# EAGLE design leddriverx3 (EAGLE 9.4.2)
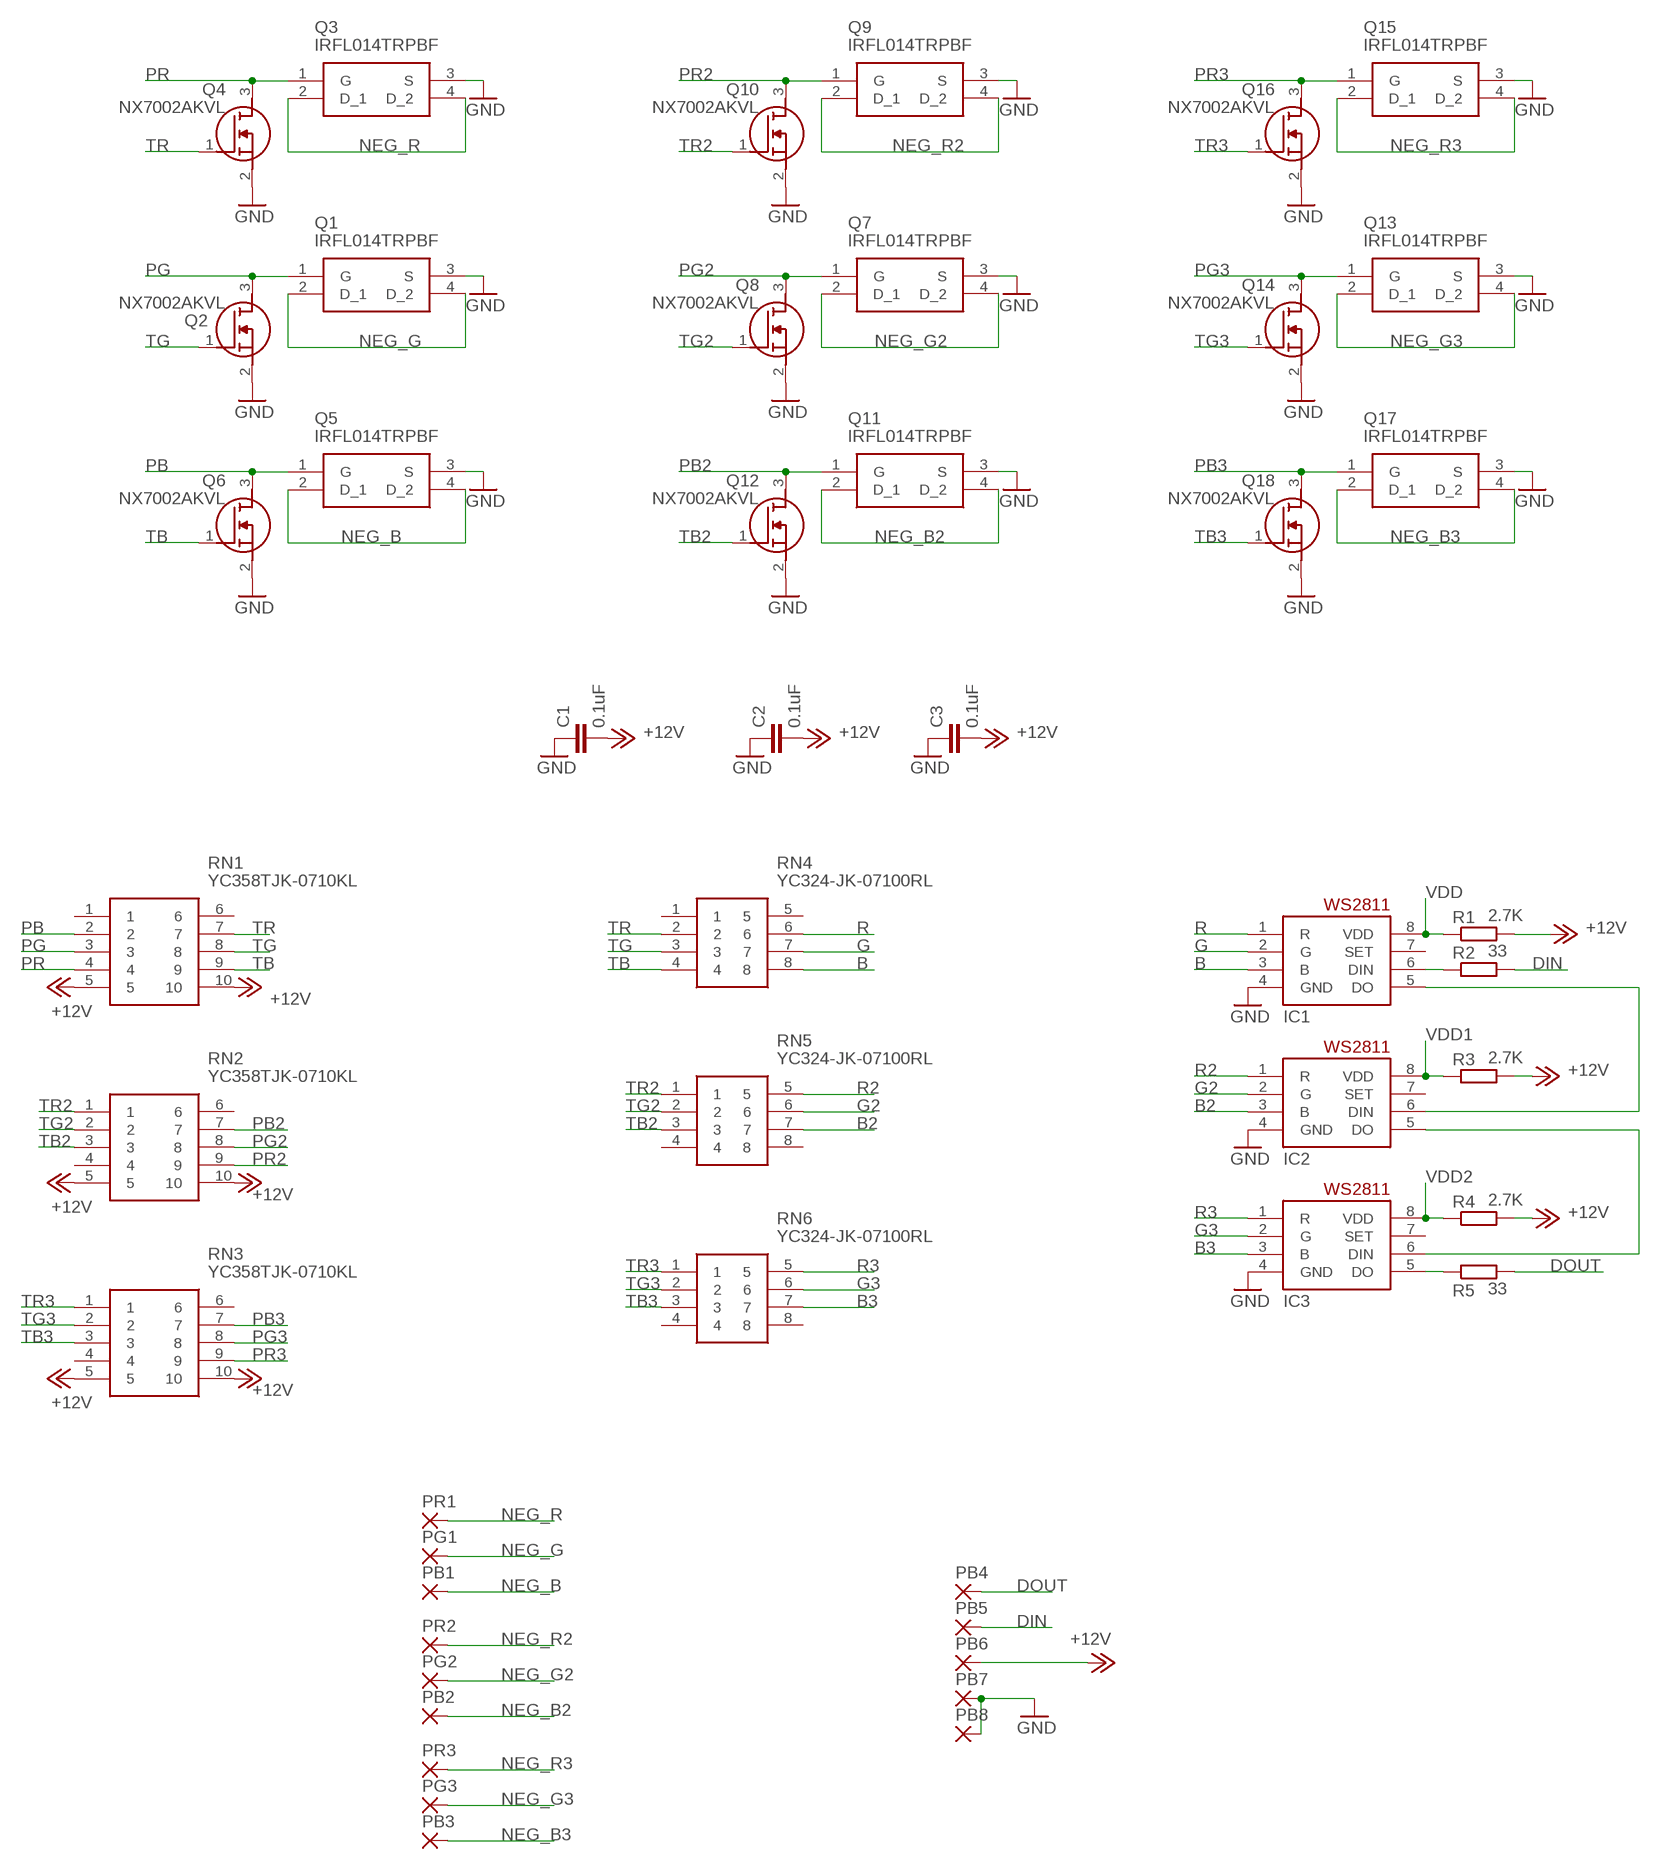
[diagram p0: schematic, sheet 1]

## Parts
C1  0.1uF  C-EUC1206  [C1206]
C2  0.1uF  C-EUC1206  [C1206]
C3  0.1uF  C-EUC1206  [C1206]
IC1  WS2811-SOP8  [SO08-SKINNYPADS]
IC2  WS2811-SOP8  [SO08-SKINNYPADS]
IC3  WS2811-SOP8  [SO08-SKINNYPADS]
PB1  3,81/1,4  [3,81/1,4]
PB2  3,81/1,4  [3,81/1,4]
PB3  3,81/1,4  [3,81/1,4]
PB4  3,81/1,4  [3,81/1,4]
PB5  3,81/1,4  [3,81/1,4]
PB6  3,81/1,4  [3,81/1,4]
PB7  3,81/1,4  [3,81/1,4]
PB8  3,81/1,4  [3,81/1,4]
PG1  3,81/1,4  [3,81/1,4]
PG2  3,81/1,4  [3,81/1,4]
PG3  3,81/1,4  [3,81/1,4]
PR1  3,81/1,4  [3,81/1,4]
PR2  3,81/1,4  [3,81/1,4]
PR3  3,81/1,4  [3,81/1,4]
Q1  IRFL014TRPBF  [SOT230P700X180-4N]
Q2  NX7002AKVL  [SOT95P230X110-3N]
Q3  IRFL014TRPBF  [SOT230P700X180-4N]
Q4  NX7002AKVL  [SOT95P230X110-3N]
Q5  IRFL014TRPBF  [SOT230P700X180-4N]
Q6  NX7002AKVL  [SOT95P230X110-3N]
Q7  IRFL014TRPBF  [SOT230P700X180-4N]
Q8  NX7002AKVL  [SOT95P230X110-3N]
Q9  IRFL014TRPBF  [SOT230P700X180-4N]
Q10  NX7002AKVL  [SOT95P230X110-3N]
Q11  IRFL014TRPBF  [SOT230P700X180-4N]
Q12  NX7002AKVL  [SOT95P230X110-3N]
Q13  IRFL014TRPBF  [SOT230P700X180-4N]
Q14  NX7002AKVL  [SOT95P230X110-3N]
Q15  IRFL014TRPBF  [SOT230P700X180-4N]
Q16  NX7002AKVL  [SOT95P230X110-3N]
Q17  IRFL014TRPBF  [SOT230P700X180-4N]
Q18  NX7002AKVL  [SOT95P230X110-3N]
R1  2.7K  R-EU_R1206  [R1206]
R2  33  R-EU_R1206  [R1206]
R3  2.7K  R-EU_R1206  [R1206]
R4  2.7K  R-EU_R1206  [R1206]
R5  33  R-EU_R1206  [R1206]
RN1  YC358TJK-0710KL  [YC358T]
RN2  YC358TJK-0710KL  [YC358T]
RN3  YC358TJK-0710KL  [YC358T]
RN4  YC324-JK-07100RL  [YC324JK07100RL]
RN5  YC324-JK-07100RL  [YC324JK07100RL]
RN6  YC324-JK-07100RL  [YC324JK07100RL]

## Nets
+12V: C1.2 C2.2 C3.2 PB6.1(P) R1.2 R3.2 R4.2 RN1.5 RN1.10 RN2.5 RN2.10 RN3.5 RN3.10
B: IC1.3(B) RN4.8
B2: IC2.3(B) RN5.7
B3: IC3.3(B) RN6.7
DIN: PB5.1(P) R2.2
DOUT: PB4.1(P) R5.2
G: IC1.2(G) RN4.7
G2: IC2.2(G) RN5.6
G3: IC3.2(G) RN6.6
GND: C1.1 C2.1 C3.1 IC1.4(GND) IC2.4(GND) IC3.4(GND) PB7.1(P) PB8.1(P) Q1.3(S) Q2.2(S) Q3.3(S) Q4.2(S) Q5.3(S) Q6.2(S) Q7.3(S) Q8.2(S) Q9.3(S) Q10.2(S) Q11.3(S) Q12.2(S) Q13.3(S) Q14.2(S) Q15.3(S) Q16.2(S) Q17.3(S) Q18.2(S)
N$1: IC1.6(DIN) R2.1
N$2: IC3.5(DO) R5.1
N$5: IC1.5(DO) IC2.6(DIN)
N$11: IC2.5(DO) IC3.6(DIN)
NEG_B: PB1.1(P) Q5.2(D_1) Q5.4(D_2)
NEG_B2: PB2.1(P) Q11.2(D_1) Q11.4(D_2)
NEG_B3: PB3.1(P) Q17.2(D_1) Q17.4(D_2)
NEG_G: PG1.1(P) Q1.2(D_1) Q1.4(D_2)
NEG_G2: PG2.1(P) Q7.2(D_1) Q7.4(D_2)
NEG_G3: PG3.1(P) Q13.2(D_1) Q13.4(D_2)
NEG_R: PR1.1(P) Q3.2(D_1) Q3.4(D_2)
NEG_R2: PR2.1(P) Q9.2(D_1) Q9.4(D_2)
NEG_R3: PR3.1(P) Q15.2(D_1) Q15.4(D_2)
PB: Q5.1(G) Q6.3(D) RN1.2
PB2: Q11.1(G) Q12.3(D) RN2.7
PB3: Q17.1(G) Q18.3(D) RN3.7
PG: Q1.1(G) Q2.3(D) RN1.3
PG2: Q7.1(G) Q8.3(D) RN2.8
PG3: Q13.1(G) Q14.3(D) RN3.8
PR: Q3.1(G) Q4.3(D) RN1.4
PR2: Q9.1(G) Q10.3(D) RN2.9
PR3: Q15.1(G) Q16.3(D) RN3.9
R: IC1.1(R) RN4.6
R2: IC2.1(R) RN5.5
R3: IC3.1(R) RN6.5
TB: Q6.1(G) RN1.9 RN4.4
TB2: Q12.1(G) RN2.3 RN5.3
TB3: Q18.1(G) RN3.3 RN6.3
TG: Q2.1(G) RN1.8 RN4.3
TG2: Q8.1(G) RN2.2 RN5.2
TG3: Q14.1(G) RN3.2 RN6.2
TR: Q4.1(G) RN1.7 RN4.2
TR2: Q10.1(G) RN2.1 RN5.1
TR3: Q16.1(G) RN3.1 RN6.1
VDD: IC1.8(VDD) R1.1
VDD1: IC2.8(VDD) R3.1
VDD2: IC3.8(VDD) R4.1
Unconnected: IC1.7(SET) IC2.7(SET) IC3.7(SET) RN1.1 RN1.6 RN2.4 RN2.6 RN3.4 RN3.6 RN4.1 RN4.5 RN5.4 RN5.8 RN6.4 RN6.8

## Library data of the parts
C1-C3 = rcl:C-EU: CAPACITOR, European symbol; SPICEPREFIX: C
IC1-IC3 = adafruit_wsled:WS2811
PB1-PB8 PG1-PG3 PR1-PR3 = wirepad:3,81/1,4: THROUGH-HOLE PAD
Q1 Q3 Q5 Q7 Q9 Q11 Q13 Q15 Q17 = SamacSys_Parts:IRFL014TRPBF: Vishay IRFL014TRPBF N-channel MOSFET Transistor, 2.7 A, 60 V, 3-Pin SOT-223 Source: Datasheet <https://componentsearchengine.com/Datasheets/1/IRFL014TRPBF.pdf>; DESCRIPTION: Vishay IRFL014TRPBF N-channel MOSFET Transistor, 2.7 A, 60 V, 3-Pin SOT-223; HEIGHT: 1.8mm; MANUFACTURER_NAME: Vishay; MANUFACTURER_PART_NUMBER: IRFL014TRPBF; MOUSER_PART_NUMBER: 844-IRFL014TRPBF; MOUSER_PRICE-STOCK: https://www.mouser.com/Search/Refine.aspx?Keyword=844-IRFL014TRPBF
Q2 Q4 Q6 Q8 Q10 Q12 Q14 Q16 Q18 = SamacSys_Parts:NX7002AKVL: Trans MOSFET N-CH 60V 0.19A 3-Pin TO-236AB Source: Datasheet <https://componentsearchengine.com/Datasheets/1/NX7002AKVL.pdf>; DESCRIPTION: Trans MOSFET N-CH 60V 0.19A 3-Pin TO-236AB; HEIGHT: 1.1mm; MANUFACTURER_NAME: Nexperia; MANUFACTURER_PART_NUMBER: NX7002AKVL; MOUSER_PART_NUMBER: 771-NX7002AKVL; MOUSER_PRICE-STOCK: https://www.mouser.com/Search/Refine.aspx?Keyword=771-NX7002AKVL
R1-R5 = rcl:R-EU_: RESISTOR, European symbol; SPICEPREFIX: R
RN1-RN3 = SamacSys_Parts:YC358TJK-0710KL: Resistor Networks & Arrays 10K 5% CONVEX SQUARE 8X1225 Source: Datasheet <https://componentsearchengine.com/Datasheets/1/YC358TJK-0710KL.pdf>; DESCRIPTION: Resistor Networks & Arrays 10K 5% CONVEX SQUARE 8X1225; HEIGHT: mm; MANUFACTURER_NAME: YAGEO (PHYCOMP); MANUFACTURER_PART_NUMBER: YC358TJK-0710KL; MOUSER_PART_NUMBER: 603-YC358TJK-0710KL; MOUSER_PRICE-STOCK: https://www.mouser.com/Search/Refine.aspx?Keyword=603-YC358TJK-0710KL
RN4-RN6 = SamacSys_Parts:YC324-JK-07100RL: Resistor Networks & Arrays Source: Datasheet <https://componentsearchengine.com/Datasheets/1/YC324-JK-07100RL.pdf>; DESCRIPTION: Resistor Networks & Arrays; HEIGHT: 0.6mm; MANUFACTURER_NAME: YAGEO (PHYCOMP); MANUFACTURER_PART_NUMBER: YC324-JK-07100RL; MOUSER_PART_NUMBER: 603-YC324-JK-07100RL; MOUSER_PRICE-STOCK: https://www.mouser.com/Search/Refine.aspx?Keyword=603-YC324-JK-07100RL

## Board
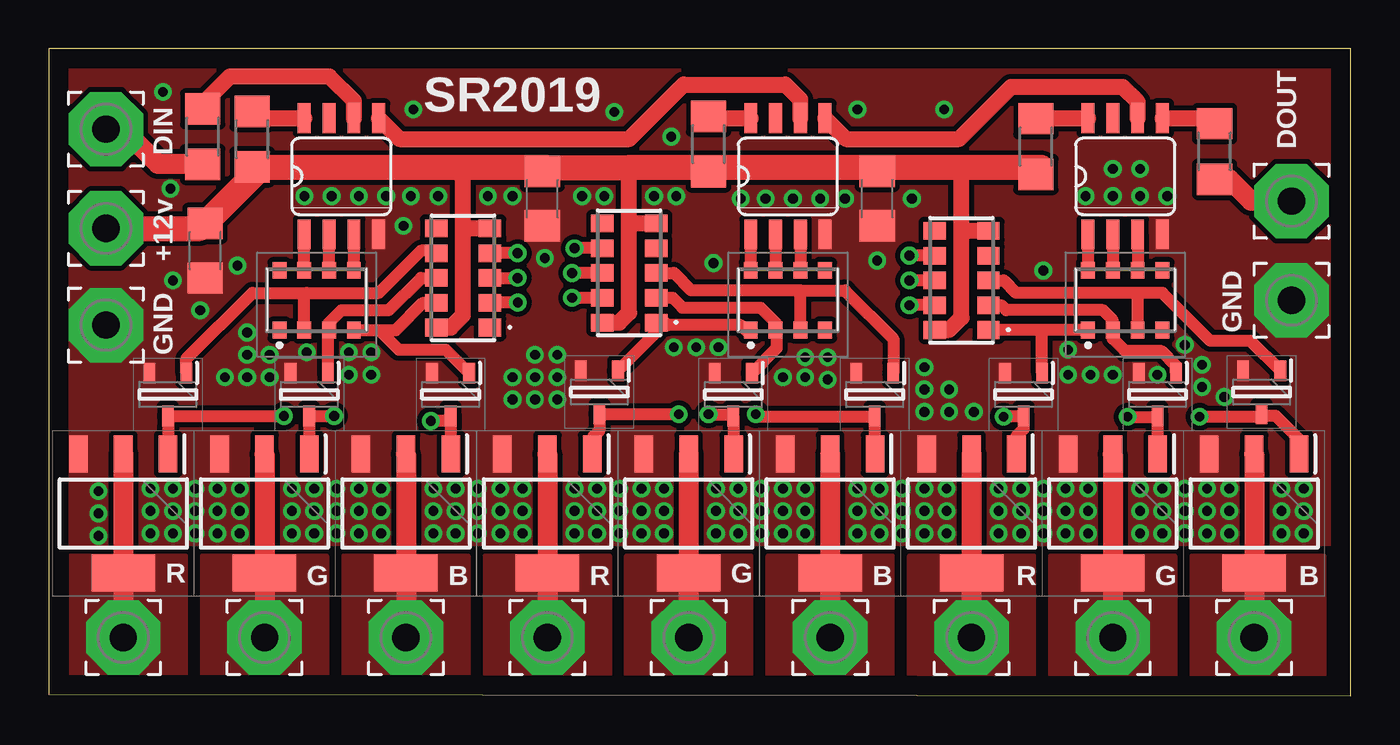
[diagram p1: board, top side]
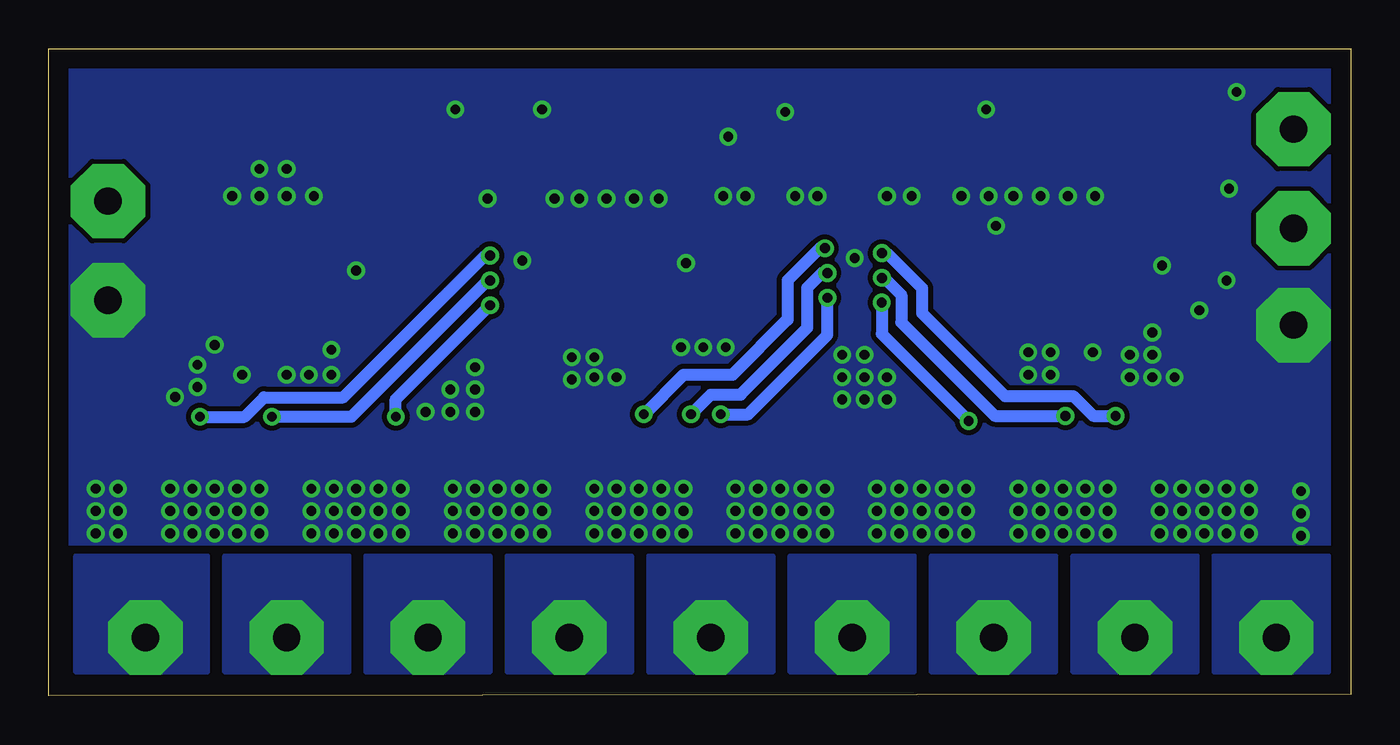
[diagram p2: board, bottom side, seen from below]

Size 66.66 x 33.14 mm. Coordinates in mm from the lower left corner, seen from the top.
Outline: 0,0.06 66.66,0 66.66,33.14 0,33.14 0,0.06
Copper layers (1*16): Top 0.035mm / dielectric 1.5mm / Bottom 0.035mm
Design rules "default *": minimum track width 6mil, minimum drill 0.35mm, track to track 6mil, track to pad 6mil, pad to pad 6mil, via to via 6mil, smd to smd 6mil, copper to edge 40mil, drill to drill 6mil, minimum pad ring 10mil, minimum via ring 8mil, stop-mask expansion 4mil, vias tented up to drill 100mil, thermal gap 10mil

### Footprints (pad centres in the part's own frame; a part is rotated, then mirrored left to right if it is on the bottom)
C1206 = smd 1.6 x 1.8: 1 -1.4,0; 2 1.4,0
SO08-SKINNYPADS = smd 0.66 x 1.524: 1 -1.905,-2.973; 2 -0.635,-2.973; 3 0.635,-2.973; 4 1.905,-2.973; 5 1.905,2.973; 6 0.635,2.973; 7 -0.635,2.973; 8 -1.905,2.973
3,81/1,4 = drill 1.397 pad 3.81 octagon: 1 0,0
SOT230P700X180-4N = smd 1.9 x 0.95: 1 -3.05,2.3; 2 -3.05,0; 3 -3.05,-2.3 | smd 1.9 x 3.25: 4 3.05,0
SOT95P230X110-3N = smd 1.05 x 0.6: 1 -1.1,0.95; 2 -1.1,-0.95; 3 1.1,0
R1206 = smd 1.6 x 1.803: 1 -1.422,0; 2 1.422,0
YC358T = smd 0.9 x 1.15: 1 -2.54,-1.375; 2 -1.27,-1.375; 3 0,-1.375; 4 1.27,-1.375; 5 2.54,-1.375; 6 2.54,1.375; 7 1.27,1.375; 8 0,1.375; 9 -1.27,1.375; 10 -2.54,1.375
YC324JK07100RL = smd 0.71 x 0.85: 1 -1.905,-1.525; 2 -0.635,-1.525; 3 0.635,-1.525; 4 1.905,-1.525; 5 -1.905,1.525; 6 -0.635,1.525; 7 0.635,1.525; 8 1.905,1.525

### Placement (x,y rotation side)
C1  25.27,25.46 90 top
C2  8,22.8 90 top
C3  42.42,25.46 90 top
IC1  14.99,26.61 0 top
IC2  37.85,26.61 0 top
IC3  55.12,26.61 0 top
PB1  18.29,2.98 180 top
PB2  40,2.98 0 top
PB3  61.72,2.98 0 top
PB4  63.63,25.34 0 top
PB5  2.92,29.02 0 top
PB6  2.92,23.94 0 top
PB7  2.92,18.99 0 top
PB8  63.63,20.26 0 top
PG1  11.05,2.98 180 top
PG2  32.77,2.98 0 top
PG3  54.48,2.98 0 top
PR1  3.81,2.98 180 top
PR2  25.53,2.98 0 top
PR3  47.24,2.98 0 top
Q1  11.05,9.33 270 top
Q2  13.33,15.43 270 top
Q3  3.81,9.33 270 top
Q4  6.1,15.43 270 top
Q5  18.29,9.33 270 top
Q6  20.57,15.43 270 top
Q7  32.77,9.33 270 top
Q8  35.05,15.43 270 top
Q9  25.53,9.33 270 top
Q10  28.19,15.56 270 top
Q11  40,9.33 270 top
Q12  42.29,15.43 270 top
Q13  54.48,9.33 270 top
Q14  56.77,15.43 270 top
Q15  47.24,9.33 270 top
Q16  49.91,15.43 270 top
Q17  61.72,9.33 270 top
Q18  62.1,15.56 270 top
R1  10.41,28.51 270 top
R2  7.87,28.64 270 top
R3  33.78,28.26 270 top
R4  50.55,28.13 270 top
R5  59.69,27.88 270 top
RN1  21.21,21.4 90 top
RN2  29.72,21.65 90 top
RN3  46.74,21.27 90 top
RN4  13.72,20.26 0 top
RN5  37.85,20.26 0 top
RN6  55.12,20.26 0 top

### Tracks (layer width: path | path; a pad name or v marks a point on that pad's centre or on a via)
+12V
  Top 0.61: C2.2 7.75,23.94 | R4.2 50.8,26.96 50.8,27.05 | R3.2 33.56,27.05 33.53,27.05 | R1.2 10.83,27.09 10.86,27.05
  Top 0.813: RN1.10 20.57,18.86 21.21,19.49 21.21,23.94 | 21.21,23.94 21.21,26.55 20.7,27.05 | RN1.5 21.21,23.94 | RN2.10 29.21,19.11 29.72,19.62 29.72,24.19 | 29.72,24.19 29.72,27.05 | RN2.5 29.72,24.19 | RN3.10 46.1,18.73 46.74,19.37 46.74,23.94 | 46.86,27.05 46.74,26.93 46.74,23.94 | RN3.5 46.86,23.81 46.74,23.94
  Top 1.27: PB6.1 7.75,23.94 10.86,27.05 20.7,27.05 25.46,27.05 | 25.46,27.05 29.72,27.05 33.53,27.05 42.61,27.05 | 50.8,27.05 46.86,27.05 42.61,27.05 | C3.2 42.61,27.05 | C1.2 25.46,27.05
B
  Top 0.61: RN4.8 IC1.3
B2
  Top 0.61: IC2.3 RN5.7
B3
  Top 0.61: IC3.3 RN6.7
DIN
  Top 1.016: R2.2 7.85,27.24 5.59,27.24 3.81,29.02 PB5.1
DOUT
  Top 1.016: PB4.1 61.57,25.34 60.45,26.45 R5.2
G
  Top 0.61: RN4.7 IC1.2
G2
  Top 0.61: IC2.2 RN5.6
G3
  Top 0.61: IC3.2 RN6.6
GND  (via drill 0.5)
  other vias: 5.21,10.6 18.54,25.59 22.48,25.59 11.3,17.46 13.21,17.59 10.16,17.46 11.3,16.32 56.77,16.45 59.05,16.95 58.17,17.97 55.88,26.99 15.87,25.59 28.96,29.91 41.4,30.04 17.27,25.59 27.3,25.59 23.75,25.59 28.45,25.59 30.99,25.59 32.13,25.59 35.43,25.46 54.48,26.99 15.37,17.59 16.51,17.59 15.37,16.45 16.51,16.45 10.16,16.32 32,17.84 33.15,17.84 34.29,17.84 31.88,28.64 10.16,18.61 9.02,16.32 26.03,17.46 26.03,16.32 24.89,17.46 24.89,16.32 26.03,15.18 24.89,15.18 23.75,15.18 23.75,16.32 6.35,10.6 5.21,9.46 5.21,8.32 6.35,9.46 6.35,8.32 7.49,10.6 8.64,10.6 9.78,10.6 7.49,9.46 8.64,9.46 9.78,9.46 9.78,8.32 7.49,8.32 8.64,8.32 12.45,10.6 13.59,10.6 12.45,9.46 12.45,8.32 13.59,9.46 13.59,8.32 14.73,10.6 15.87,10.6 17.02,10.6 14.73,9.46 15.87,9.46 17.02,9.46 17.02,8.32 14.73,8.32 15.87,8.32 19.69,10.6 20.83,10.6 19.69,9.46 19.69,8.32 20.83,9.46 20.83,8.32 21.97,10.6 23.11,10.6 24.26,10.6 21.97,9.46 23.11,9.46 24.26,9.46 24.26,8.32 21.97,8.32 23.11,8.32 26.92,10.6 28.07,10.6 26.92,9.46 26.92,8.32 28.07,9.46 28.07,8.32 29.21,10.6 30.35,10.6 31.5,10.6 29.21,9.46 30.35,9.46 31.5,9.46 31.5,8.32 29.21,8.32 30.35,8.32 34.16,10.6 35.31,10.6 34.16,9.46 34.16,8.32 35.31,9.46 35.31,8.32 36.45,10.6 37.59,10.6 38.73,10.6 36.45,9.46 37.59,9.46 38.73,9.46 38.73,8.32 36.45,8.32 37.59,8.32 41.4,10.6 42.54,10.6 41.4,9.46 41.4,8.32 42.54,9.46 42.54,8.32 43.69,10.6 44.83,10.6 45.97,10.6 43.69,9.46 44.83,9.46 45.97,9.46 45.97,8.32 43.69,8.32 44.83,8.32 48.64,10.6 49.78,10.6 48.64,9.46 48.64,8.32 49.78,9.46 49.78,8.32 50.93,10.6 52.07,10.6 53.21,10.6 50.93,9.46 52.07,9.46 53.21,9.46 53.21,8.32 50.93,8.32 52.07,8.32 55.88,10.6 57.02,10.6 55.88,9.46 55.88,8.32 57.02,9.46 57.02,8.32 58.17,10.6 59.31,10.6 60.45,10.6 58.17,9.46 59.31,9.46 60.45,9.46 60.45,8.32 58.17,8.32 59.31,8.32 63.12,10.6 64.26,10.6 63.12,9.46 64.26,9.46 64.26,8.32 63.12,8.32 2.54,10.48 2.54,9.33 2.54,8.19 53.09,25.59 54.48,25.59 55.88,25.59 57.28,25.59 19.94,25.59 18.16,24.07 45.85,30.04 18.67,30.04 6.22,25.97 5.84,30.92 39.88,17.34 39.88,16.19 38.73,17.34 38.73,16.32 37.59,16.32 47.37,14.54 46.1,14.54 44.83,14.54 44.83,15.68 46.1,15.68 54.48,16.45 53.34,16.45 52.2,16.45 52.2,17.72 59.05,15.81 60.2,15.3 44.83,16.83 14.48,25.59 13.08,25.59 6.35,21.27 40.77,25.46 39.5,25.46 38.1,25.46 36.7,25.46 42.42,22.29 44.2,25.46 25.4,22.42 7.75,19.75 9.65,22.03 34.04,22.16 50.93,21.78
  pour Bottom (isolate 0.254, no thermals): -1.4,35.24 -1.4,8.95 67.18,8.95 67.18,35.24
  pour Top (isolate 0.254, no thermals): -0.89,34.86 -0.89,7.81 67.44,7.81 67.44,34.86
  pour Bottom (isolate 0.254, no thermals): -0.13,34.99 -0.13,7.81 67.18,7.81 67.18,34.99
N$1
  Top 0.813: IC1.6 15.62,30.47 14.38,31.71 9.27,31.71 7.87,30.31 R2.1
N$2
  Top 0.813: IC3.5 59.69,29.58 R5.1
N$5
  Top 0.813: IC1.5 17.96,28.51 29.72,28.51 32.51,31.31 37.72,31.31 38.48,30.54 IC2.6
N$11
  Top 0.813: IC2.5 40.82,28.51 46.61,28.51 49.28,31.18 54.99,31.18 55.75,30.42 IC3.6
NEG_B
  Top 1.016: Q5.2 Q5.4 PB1.1
  pour Top (isolate 0.254, no thermals): 15.11,7.18 21.46,7.18 21.46,0.19 15.24,0.19 15.11,0.19
  pour Bottom (no thermals): 15.11,1.21 21.46,1.21 21.46,7.18 15.11,7.18
NEG_B2
  Top 1.016: Q11.2 Q11.4 PB2.1
  pour Top (isolate 0.254, no thermals): 36.83,7.18 43.18,7.18 43.18,0.44 36.83,0.44
  pour Bottom (no thermals): 36.83,1.21 43.18,1.21 43.18,7.18 36.83,7.18
NEG_B3
  Top 1.016: Q17.2 Q17.4 PB3.1
  pour Top (isolate 0.254, no thermals): 58.55,7.18 65.28,7.18 65.28,0.32 58.55,0.32
  pour Bottom (no thermals): 58.55,1.21 65.28,1.21 65.28,7.18 58.55,7.18
NEG_G
  Top 1.016: Q1.2 Q1.4 PG1.1
  pour Top (isolate 0.254, no thermals): 7.87,7.18 14.22,7.18 14.22,0.19 7.87,0.19
  pour Bottom (no thermals): 7.87,1.21 14.22,1.21 14.22,7.18 7.87,7.18
NEG_G2
  Top 1.016: Q7.2 Q7.4 PG2.1
  pour Top (isolate 0.254, no thermals): 29.59,7.18 35.94,7.18 35.94,0.95 29.59,0.95
  pour Bottom (no thermals): 29.59,1.21 35.94,1.21 35.94,7.18 29.59,7.18
NEG_G3
  Top 1.016: Q13.2 Q13.4 PG3.1
  pour Top (isolate 0.254, no thermals): 51.31,7.18 57.66,7.18 57.66,0.19 51.31,0.19
  pour Bottom (no thermals): 51.31,1.21 57.66,1.21 57.66,7.18 51.31,7.18
NEG_R
  Top 1.016: Q3.2 Q3.4 PR1.1
  pour Top (isolate 0.254, no thermals): 0.63,7.18 6.98,7.18 6.98,0.19 0.63,0.19
  pour Bottom (no thermals): 1.14,7.18 1.14,1.21 6.98,1.21 6.98,7.18
NEG_R2
  Top 1.016: Q9.2 Q9.4 PR2.1
  pour Top (isolate 0.254, no thermals): 22.35,7.18 28.7,7.18 28.7,0.7 22.35,0.7
  pour Bottom (no thermals): 22.35,1.21 28.7,1.21 28.7,7.18 22.35,7.18
NEG_R3
  Top 1.016: Q15.2 Q15.4 PR3.1
  pour Top (isolate 0.254, no thermals): 44.07,7.18 50.42,7.18 50.42,0.32 44.07,0.32
  pour Bottom (no thermals): 44.07,1.21 50.42,1.21 50.42,7.18 44.07,7.18
PB  (via drill 0.5)
  Top 0.61: v19.56,14.08 20.32,14.08 Q6.3 20.57,12.4 Q5.1 | v24.01,20.14 v24,20.13 RN1.2
  Bottom 0.61: v24.01,20.14 24.01,18.53 v19.56,14.08
PB2  (via drill 0.5)
  Top 0.61: Q11.1 42.29,12.4 Q12.3 42.25,14.29 36.32,14.29 v36.2,14.41 | RN2.7 v26.92,22.92
  Bottom 0.61: v26.92,22.92 27.18,22.92 28.83,21.27 28.83,19.26 31.64,16.45 34.16,16.45 v36.2,14.41
PB3  (via drill 0.5)
  Top 0.61: Q17.1 64.02,13.13 62.82,14.33 62.23,14.33 Q18.3 61.93,14.29 v58.93,14.29 | RN3.7 v44.07,22.54
  Bottom 0.61: v44.07,22.54 44.32,22.54 51.58,15.28 55.65,15.28 56.64,14.29 v58.93,14.29
PG  (via drill 0.5)
  Top 0.61: Q1.1 13.33,12.4 Q2.3 v14.6,14.33 | RN1.3 v24,21.4
  Bottom 0.61: v24,21.4 23.88,21.4 23.01,20.53 23.01,19.12 18.22,14.33 v14.6,14.33
PG2  (via drill 0.5)
  Top 0.61: Q7.1 35.05,12.4 Q8.3 34.97,14.41 v33.78,14.41 | RN2.8 v26.8,21.65
  Bottom 0.61: v26.8,21.65 27.07,21.65 27.83,20.89 27.83,18.84 31.24,15.43 32.77,15.43 v33.78,14.41
PG3  (via drill 0.5)
  Top 0.61: Q13.1 56.77,12.4 Q14.3 56.73,14.29 v55.25,14.29 | RN3.8 v44.07,21.27
  Bottom 0.61: v44.07,21.27 44.2,21.27 51.18,14.29 v55.25,14.29
PR  (via drill 0.5)
  Top 0.61: Q3.1 6.11,14.32 Q4.3 v12.04,14.33 | v24,22.67 RN1.4
  Bottom 0.61: v12.04,14.33 13.19,14.33 14.2,15.35 17.7,15.35 21.95,19.6 21.95,20.87 23.75,22.67 v24,22.67
PR2  (via drill 0.5)
  Top 0.61: Q9.1 27.83,13.2 28.19,13.57 Q10.3 28.24,14.41 v32.26,14.41 | v26.8,20.38 RN2.9
  Bottom 0.61: v32.26,14.41 30.86,14.41 26.8,18.48 v26.8,20.38
PR3  (via drill 0.5)
  Top 0.61: Q15.1 49.53,12.4 49.53,13.27 49.91,13.65 Q16.3 48.94,14.33 v48.89,14.29 | RN3.9 v44.07,20
  Bottom 0.61: v48.89,14.29 48.89,15.18 v44.07,20
R
  Top 0.61: RN4.6 IC1.1
R2
  Top 0.61: IC2.1 RN5.5
R3
  Top 0.61: IC3.1 RN6.5
TB
  Top 0.61: RN4.4 16.91,18.73 | 16.91,18.73 17.78,18.73 19.18,20.13 RN1.9 | Q6.1 20.34,17.72 17.92,17.72 16.91,18.73
TB2
  Top 0.61: RN5.3 38.48,20.76 | Q12.1 43.24,18.29 40.77,20.76 38.48,20.76 | 38.48,20.76 32.89,20.76 32,21.65 RN2.3
TB3
  Top 0.61: RN6.3 55.75,20.64 | 55.75,20.64 57.02,20.64 59.48,18.18 61.53,18.18 Q18.1 | 55.75,20.64 49.53,20.64 48.89,21.27 RN3.3
TG
  Top 0.61: Q2.1 14.28,18.67 RN4.3 14.35,19.11 14.99,19.75 17.4,19.75 19.05,21.4 RN1.8
TG2
  Top 0.61: Q8.1 37.27,17.8 37.27,18.67 RN5.2 37.21,19.11 36.45,19.88 32.45,19.88 31.94,20.38 RN2.2
TG3
  Top 0.61: Q14.1 57.72,16.91 56.98,17.65 55.12,17.65 54.48,18.29 RN6.2 54.48,19.24 53.97,19.75 49.02,19.75 48.77,20 RN3.2
TR
  Top 0.61: Q4.1 7.05,17.27 10.41,20.64 13.21,20.64 | RN4.2 13.08,20.51 13.21,20.64 | 13.21,20.64 16.89,20.64 19.05,22.8 19.71,22.8 RN1.7
TR2
  Top 0.61: RN5.1 35.69,18.73 35.43,18.99 31.68,18.99 31.56,19.11 RN2.1 31.09,18.61 Q10.1
TR3
  Top 0.61: RN6.1 50.8,18.73 | 50.8,18.73 RN3.1 | Q16.1 50.86,18.67 50.8,18.73
VDD
  Top 0.61: R1.1 10.94,29.93 11.29,29.58
  Top 0.813: 11.29,29.58 IC1.8
VDD1
  Top 0.61: R3.1 34.05,29.68 34.15,29.58
  Top 0.813: 34.15,29.58 IC2.8
VDD2
  Top 0.61: R4.1 51.4,29.55 51.43,29.58
  Top 0.813: 51.43,29.58 IC3.8

### Text on the board
tNames: DIN | SR2019 | DOUT | +12v | GND | GND | R | G | B | R | G | B | R | G | B